# EAGLE design splitter157 (EAGLE 7.3.0)
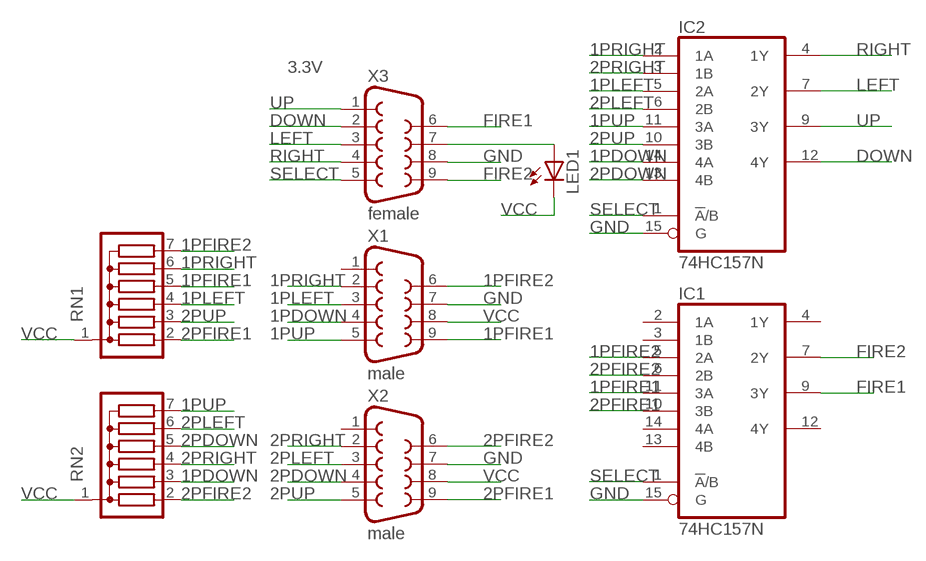
[diagram p0: schematic, sheet 1]

## Parts
IC1  74HC157N  [DIL16NUEVO]
IC2  74HC157N  [DIL16NUEVO]
LED1  LED3MM  [LED3MM]
RN1  G06R  [SIL7]
RN2  G06R  [SIL7]
X1  male  F09D  [F09D]
X2  male  F09D  [F09D]
X3  female  F09D  [F09D]

## Nets
1PDOWN: IC2.14(4A) RN2.3 X1.4
1PFIRE1: IC1.11(3A) RN1.5 X1.9
1PFIRE2: IC1.5(2A) RN1.7 X1.6
1PLEFT: IC2.5(2A) RN1.4 X1.3
1PRIGHT: IC2.2(1A) RN1.6 X1.2
1PUP: IC2.11(3A) RN2.7 X1.5
2PDOWN: IC2.13(4B) RN2.5 X2.4
2PFIRE1: IC1.10(3B) RN1.2 X2.9
2PFIRE2: IC1.6(2B) RN2.2 X2.6
2PLEFT: IC2.6(2B) RN2.6 X2.3
2PRIGHT: IC2.3(1B) RN2.4 X2.2
2PUP: IC2.10(3B) RN1.3 X2.5
DOWN: IC2.12(4Y) X3.2
FIRE1: IC1.9(3Y) X3.6
FIRE2: IC1.7(2Y) X3.9
GND: IC1.15(G) IC2.15(G) X1.7 X2.7 X3.8
LEFT: IC2.7(2Y) X3.3
N$1: LED1.A X3.7
RIGHT: IC2.4(1Y) X3.4
SELECT: IC1.1(!A!/B) IC2.1(!A!/B) X3.5
UP: IC2.9(3Y) X3.1
VCC: LED1.K(C) RN1.1 RN2.1 X1.8 X2.8
Unconnected: IC1.2(1A) IC1.3(1B) IC1.4(1Y) IC1.12(4Y) IC1.13(4B) IC1.14(4A) X1.1 X2.1

## Power pins joined to a net without a drawn wire
GND: IC1.8(GND) IC2.8(GND)
VCC: IC1.16(VCC) IC2.16(VCC)

## Library data of the parts
IC1 IC2 = 74xx-eu:74*157: Quadruple 2-line to 1-line data SELECTOR/MULTIPLEXER
LED1 = led:LED: LED OSRAM: - CHIPLED LG R971, LG N971, LY N971, LG Q971, LY Q971, LO R971, LY R971 LH N974, LH R974 LS Q976, LO Q976, LY Q976 LO Q996 - Hyper CHIPLED LW Q18S LB Q993, LB Q99A, LB R99A - SideLED LS A670, LO A670, LY A670, LG A670, LP A670 LB A673, LV A673, LT A673, LW A673 LH A674 LY A675 LS A676, LA A676, LO A676, LY A676, LW A676 LS A679, LY A679, LG A679 - Hyper Micro SIDELED® LS Y876, LA Y876, LO Y876, LY Y876 LT Y87S - SmartLED LW L88C, LW L88S LB L89C, LB L89S, LG L890 LS L89K, LO L89K, LY L89K LS L896, LA L896, LO L896, LY L896 - TOPLED LS T670, LO T670, LY T670, LG T670, LP T670 LSG T670, LSP T670, LSY T670, LOP T670, LYG T670 LG T671, LOG T671, LSG T671 LB T673, LV T673, LT T673, LW T673 LH T674 LS T676, LA T676, LO T676, LY T676, LB T676, LH T676, LSB T676, LW T676 LB T67C, LV T67C, LT T67C, LS T67K, LO T67K, LY T67K, LW E67C LS E67B, LA E67B, LO E67B, LY E67B, LB E67C, LV E67C, LT E67C LW T67C LS T679, LY T679, LG T679 LS T770, LO T770, LY T770, LG T770, LP T770 LB T773, LV T773, LT T773, LW T773 LH T774 LS E675, LA E675, LY E675, LS T675 LS T776, LA T776, LO T776, LY T776, LB T776 LHGB T686 LT T68C, LB T68C - Hyper Mini TOPLED® LB M676 - Mini TOPLED Santana® LG M470 LS M47K, LO M47K, LY M47K Source: http://www.osram.convergy.de LUXEON: - LUMILED® LXK2-PW12-R00, LXK2-PW12-S00, LXK2-PW14-U00, LXK2-PW14-V00 LXK2-PM12-R00, LXK2-PM12-S00, LXK2-PM14-U00 LXK2-PE12-Q00, LXK2-PE12-R00, LXK2-PE12-S00, LXK2-PE14-T00, LXK2-PE14-U00 LXK2-PB12-K00, LXK2-PB12-L00, LXK2-PB12-M00, LXK2-PB14-N00, LXK2-PB14-P00, LXK2-PB14-Q00 LXK2-PR12-L00, LXK2-PR12-M00, LXK2-PR14-Q00, LXK2-PR14-R00 LXK2-PD12-Q00, LXK2-PD12-R00, LXK2-PD12-S00 LXK2-PH12-R00, LXK2-PH12-S00 LXK2-PL12-P00, LXK2-PL12-Q00, LXK2-PL12-R00 Source: www.luxeon.com KINGBRIGHT: KA-3528ASYC Source: www.kingbright.com
RN1 RN2 = resistor-sil:G06R: SIL RESISTOR; OC_FARNELL: unknown; OC_NEWARK: unknown
X1-X3 = con-subd:F09: SUB-D; OC_FARNELL: unknown; OC_NEWARK: unknown

## Board
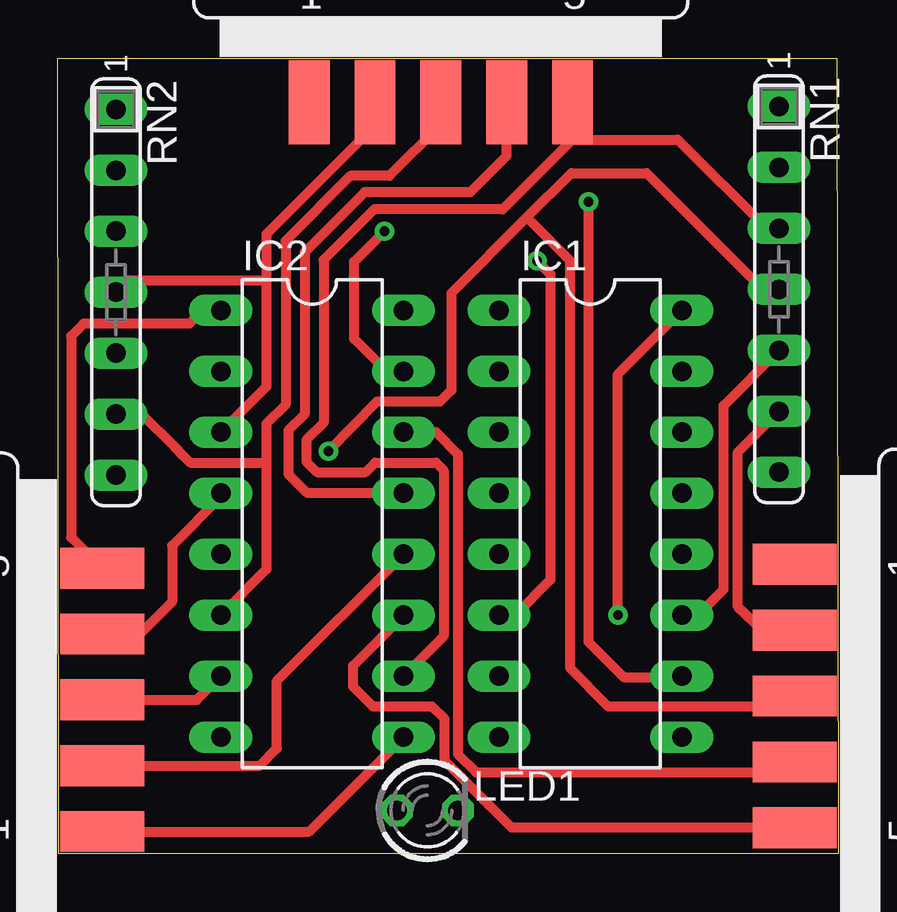
[diagram p1: board, top side]
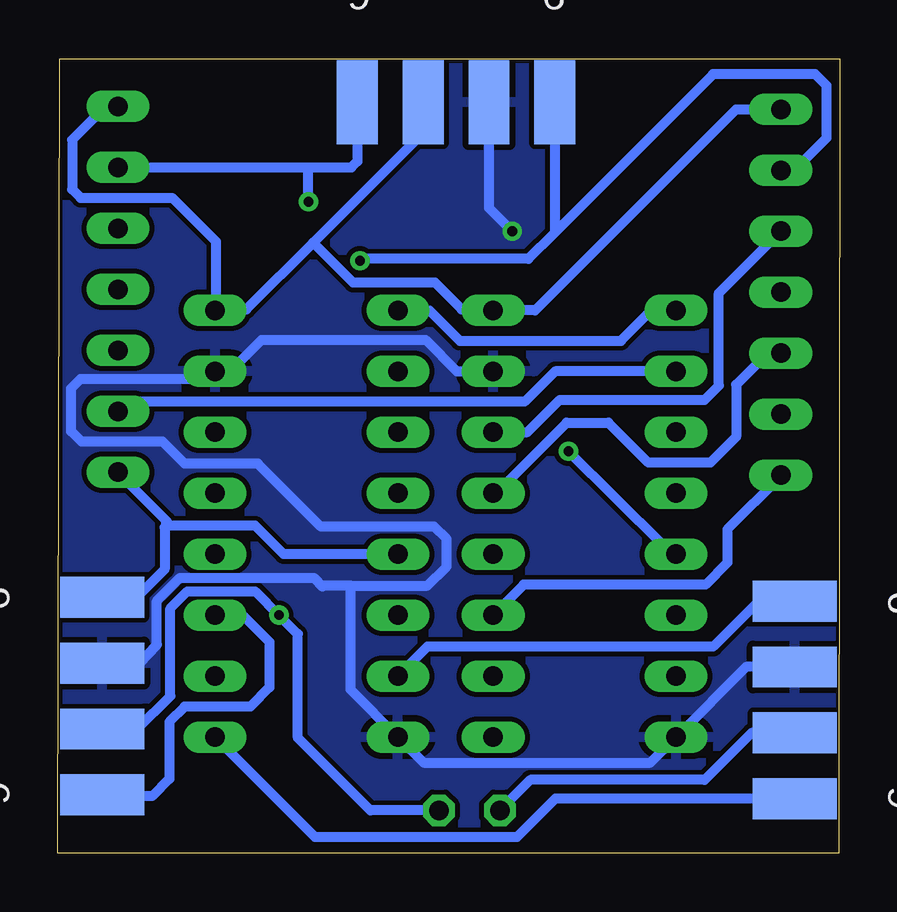
[diagram p2: board, bottom side, seen from below]

No outline drawn. Coordinates in mm, seen from the top.
Copper layers (1*16): Top 0.035mm / dielectric 1.5mm / Bottom 0.035mm
Design rules "default": minimum track width 10mil, minimum drill 24mil, track to track 8mil, track to pad 8mil, pad to pad 8mil, via to via 8mil, smd to smd 8mil, copper to edge 40mil, drill to drill 8mil, minimum pad ring 10mil, minimum via ring 8mil, stop-mask expansion 4mil, vias tented up to drill 0mil, thermal gap 10mil
Milling: 4 lines

### Footprints (pad centres in the part's own frame; a part is rotated, then mirrored left to right if it is on the bottom)
DIL16NUEVO = drill 0.813 long: 1 -8.89,-3.81; 2 -6.35,-3.81; 3 -3.81,-3.81; 4 -1.27,-3.81; 5 1.27,-3.81; 6 3.81,-3.81; 7 6.35,-3.81; 8 8.89,-3.81; 9 8.89,3.81; 10 6.35,3.81; 11 3.81,3.81; 12 1.27,3.81; 13 -1.27,3.81; 14 -3.81,3.81; 15 -6.35,3.81; 16 -8.89,3.81
LED3MM = drill 0.813 octagon: A -1.27,0; K 1.27,0
SIL7 = drill 0.813 long: 1 -7.62,0; 2 -5.08,0; 3 -2.54,0; 4 0,0; 5 2.54,0; 6 5.08,0; 7 7.62,0
F09D = smd 1.7 x 3.5: 1 -5.486,-6.045; 2 -2.743,-6.045; 3 0,-6.045; 4 2.743,-6.045; 5 5.486,-6.045 | smd 1.7 x 3.5 bottom: 6 -4.115,-6.045; 7 -1.372,-6.045; 8 1.372,-6.045; 9 4.115,-6.045

### Placement (x,y rotation side)
IC1  22.19,13.73 270 top
IC2  10.6,13.73 270 top
LED1  15.4,1.79 0 top
RN1  30.04,23.5 270 top
RN2  2.42,23.38 270 top
X1  36.75,6.55 270 top
X2  15.95,37.35 0 top
X3  -4.21,6.39 90 top

### Tracks (layer width: path | path; a pad name or v marks a point on that pad's centre or on a via)
1PDOWN
  Top 0.406: IC2.14 15.76,17.54 16.67,16.63 16.67,4.13 17.42,3.37 29.13,3.37 29.56,3.81 X1.4
  Bottom 0.406: IC2.14 12.98,17.54 11.63,18.89 5.6,18.89 5,19.49 5,23.34 RN2.3
1PFIRE1
  Top 0.406: IC1.11 26.67,9.92 27.74,10.99 27.74,18.65 RN1.5
  Bottom 0.406: IC1.11 24.84,9.92 23.73,8.81 23.73,6.91 24.53,6.11 27.27,6.11 27.9,5.48 27.9,3.1 28.61,2.38 30.65,2.38 X1.9
1PFIRE2
  Bottom 0.406: IC1.5 23.14,12.46 24.33,13.65 28.02,13.65 | X1.6 30.61,10.76 29.17,10.76 28.1,11.83 28.1,13.57 28.02,13.65 | 28.02,13.65 28.02,13.85 RN1.7
1PLEFT  (via drill 0.4)
  Top 0.406: v11.27,16.75 13.29,18.81 15.91,18.81 16.39,19.29 16.39,23.34 19.55,26.49 | X1.3 29.33,6.55 29.13,6.11 22.94,6.11 21.35,7.7 21.35,24.69 19.55,26.49 | 19.55,26.49 21.39,28.34 24.53,28.34 29.41,23.45 30,23.45 RN1.4
  Bottom 0.406: IC2.5 7.3,12.46 7.3,12.82 v11.27,16.75
1PRIGHT
  Top 0.406: X1.2 29.36,9.29 28.34,10.28 28.34,16.71 RN1.6
  Bottom 0.406: IC2.2 11.83,20.08 13.1,18.81 29.65,18.81 RN1.6
1PUP
  Top 0.406: IC2.11 12.3,7.82 12.3,6.95 13.14,6.11 15.6,6.11 16.11,5.6 16.11,3.85 17.74,2.22 17.95,2.02 18.9,1.06 X1.5
  Bottom 0.406: RN2.7 2.42,15.72 4.64,13.49 4.64,12.11 5.56,11.19 13.14,11.19 IC2.11
2PDOWN
  Top 0.406: X2.4 18.7,29.06 17.18,27.54 12.78,27.54 10.28,25.04 10.28,18.3 9.6,17.62 9.6,15.8 10.4,15 IC2.13
  Bottom 0.406: RN2.5 2.98,20.84 4.29,19.53 4.29,17.34 5.36,16.27 7.94,16.27 9.6,17.94 11.35,17.94 14.29,15 IC2.13
2PFIRE1  (via drill 0.4)
  Top 0.406: v22.11,27.15 22.11,8.81 23.57,7.34 25.96,7.34 IC1.10
  Bottom 0.406: X2.9 20.07,28.83 20.32,28.57 22.23,28.57 | RN1.2 22.23,28.57 | v22.11,27.15 22.11,28.46 22.23,28.57
2PFIRE2  (via drill 0.4)
  Top 0.406: IC1.6 19.05,9.92 20.52,11.39 20.52,24.13 v19.96,24.69
  Bottom 0.406: X2.6 11.84,25.86 | 11.84,25.86 12.94,24.77 19.88,24.77 v19.96,24.69 | RN2.2 1.86,28.46 0.52,29.8 0.52,31.99 0.99,32.46 5.24,32.46 11.84,25.86
2PLEFT
  Top 0.406: X2.3 15.95,30.36 13.81,28.22 12.18,28.22 9.48,25.52 9.48,18.69 8.69,17.9 8.69,16.23 | 8.69,16.23 8.69,11.83 IC2.6 | 8.69,16.23 8.65,16.27 5.52,16.27 5.22,16.57 4.88,16.91 3.49,18.3 RN2.6
2PRIGHT
  Top 0.406: 8.69,23.93 8.69,25.8 13.21,30.32 X2.2 | 8.69,23.93 8.69,19.45 IC2.3 | 8.69,23.93 8.61,23.85 2.9,23.85 RN2.4
2PUP
  Top 0.406: 21.44,29.73 18.53,26.83 13.18,26.83 11.07,24.73 11.07,17.94 10.36,17.22 10.36,16.31 10.79,15.88 12.82,15.88 13.22,16.27 15.76,16.27 16.07,15.95 16.07,9.05 IC2.10 | 21.44,29.73 X2.5 | 21.44,29.73 25.83,29.73 29.53,26.04 RN1.3
DOWN
  Top 0.406: X3.2 8.41,3.65 9.13,4.37 9.13,7.18 IC2.12
FIRE1
  Bottom 0.406: IC1.9 21.83,0.68 13.41,0.68 11.81,2.27 X3.6
FIRE2
  Bottom 0.406: X3.9 3.35,10.5 5.24,8.61 17.14,8.61 IC1.7
GND  (via drill 0.4)
  Top 0.406: v13.61,25.92 12.34,24.65 12.34,21.43 13.69,20.08 IC2.15
  Bottom 0.406: X2.7 14.58,26.89 v13.61,25.92 | IC2.15 15.91,20.08 17.22,21.39 24.05,21.39 25.36,20.08 IC1.15 26.31,19.76 31.59,19.76 31.99,19.37 31.99,17.58 31.55,17.14 28.18,17.14 27.27,16.23 24.21,16.23 21.59,13.61 16.87,13.61 16.35,13.1 16.35,11.95 17.14,11.15 20.36,11.15 | X3.8 3.87,7.76 IC2.8 7.86,3.77 17.3,3.77 IC1.8 20.36,6.83 20.36,11.15 | X1.7 29.15,7.92 28.42,8.69 28.42,10.52 27.46,11.47 21.87,11.47 21.51,11.11 21.47,11.15 20.36,11.15
  pour Bottom: 0.36,32.7 32.15,32.7 32.15,0.44 0.32,0.44 0.32,32.78
LEFT
  Top 0.406: X3.3 5.79,6.39 IC2.7
N$1
  Bottom 0.406: X3.7 3.63,5.02 5.6,3.06 12.86,3.06 LED1.A
RIGHT
  Top 0.406: IC2.4 6.79,14.84 4.76,12.82 4.76,10.48 3.37,9.09 1.88,9.09 X3.4
SELECT
  Top 0.406: IC2.1 6.03,22.62 5.48,22.07 1.07,22.07 0.56,21.55 0.56,13.16 X3.5
  Bottom 0.406: IC1.1 17.07,22.62 15.8,21.35 9.09,21.35 7.82,22.62 IC2.1
UP
  Top 0.406: X3.1 10.47,0.9 IC2.9
VCC  (via drill 0.4)
  Top 0.406: IC1.16 23.34,19.96 v23.34,9.92
  Bottom 0.406: 25.96,22.66 IC1.16 | X1.8 29.23,5.18 27.86,6.55 27.86,10.2 27.15,10.91 24.33,10.91 v23.34,9.92 22.54,9.13 22.54,4.8 19.53,1.79 LED1.K | RN1.1 30.04,31.16 30.52,31.16 31.95,29.73 31.95,27.66 31.59,27.3 27.78,27.3 25.96,25.48 25.96,22.66 | RN2.1 4.29,31 12.66,22.62 IC2.16 14.45,22.66 15.72,22.66 16.83,23.77 20.24,23.77 21.91,25.44 | X2.8 17.33,30.02 21.91,25.44 | 21.91,25.44 24.69,22.66 25.96,22.66